# EAGLE design prototype (EAGLE 9.0.1)
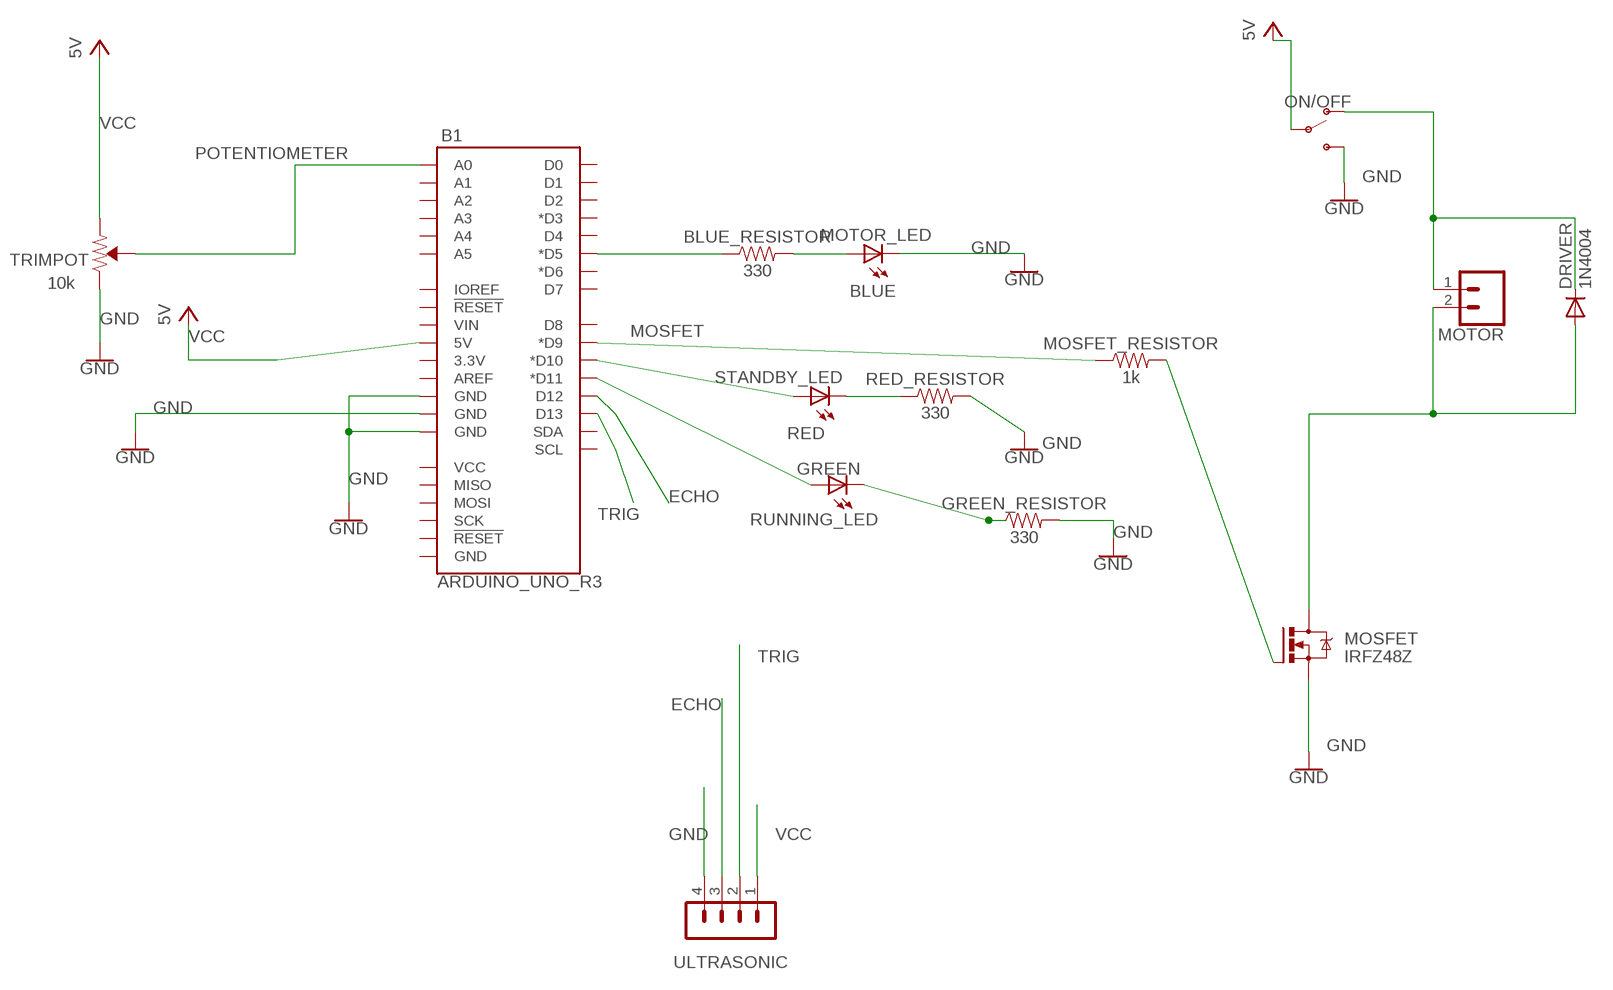
[diagram p0: schematic, sheet 1]

## Parts
B1  ARDUINO_UNO_R3  [ARDUINO_R3]
BLUE_RESISTOR  330  1KOHM-HORIZ-1/4W-1%  [AXIAL-0.3]
DRIVER  1N4004  [DO41-10]
GREEN_RESISTOR  330  330OHM-HORIZ-1/10W-5%  [AXIAL-0.3]
MOSFET  IRFZ48Z  [TO220BH]
MOSFET_RESISTOR  1k  1KOHM-HORIZ-1/4W-1%  [AXIAL-0.3]
MOTOR  CONN_02  [1X02]
MOTOR_LED  BLUE  LED5MM  [LED5MM]
ON/OFF  SWITCH-SPDT-PTH-11.6X4.0MM  [SWITCH_SPDT_PTH_11.6X4.0MM]
RED_RESISTOR  330  330OHM-HORIZ-1/10W-5%  [AXIAL-0.3]
RUNNING_LED  GREEN  LED5MM  [LED5MM]
STANDBY_LED  RED  LED5MM  [LED5MM]
TRIMPOT  10k  TRIMPOT-PTH-10MM-KNOB-1/2W-10%  [TRIMPOT-PTH-3386U]
ULTRASONIC  MA04-1  [MA04-1]

## Nets
BLUE: B1.D5(*D5) BLUE_RESISTOR.P$1
ECHO: B1.D12 ULTRASONIC.3
GND: B1.GND@2(GND) B1.GND@3(GND) B1.GND@4(GND) GREEN_RESISTOR.P$2 MOSFET.S MOTOR_LED.K(C) ON/OFF.3(S) RED_RESISTOR.P$2 TRIMPOT.3(CW) ULTRASONIC.4
GREEN: B1.D11(*D11) RUNNING_LED.A
MOSFET: B1.D9(*D9) MOSFET_RESISTOR.P$1
N$1: DRIVER.C MOTOR.1 ON/OFF.1(O)
N$4: RED_RESISTOR.P$1 STANDBY_LED.K(C)
N$5: GREEN_RESISTOR.P$1 RUNNING_LED.K(C)
N$7: MOSFET.G MOSFET_RESISTOR.P$2
N$8: BLUE_RESISTOR.P$2 MOTOR_LED.A
N$9: DRIVER.A MOSFET.D MOTOR.2
POTENTIOMETER: B1.A0 TRIMPOT.2(WIPER)
RED: B1.D10(*D10) STANDBY_LED.A
TRIG: B1.D13 ULTRASONIC.2
VCC [Power]: B1.5V ON/OFF.2(P) TRIMPOT.1(CCW) ULTRASONIC.1 ; supply symbol labelled 5V
Unconnected: B1.3.3V B1.A1 B1.A2 B1.A3 B1.A4 B1.A5 B1.AREF B1.D0 B1.D1 B1.D2 B1.D3(*D3) B1.D4 B1.D6(*D6) B1.D7 B1.D8 B1.GND@1(GND) B1.IOREF B1.MISO B1.MOSI B1.RESET@1(!RESET!) B1.RESET@2(!RESET!) B1.SCK B1.SCL B1.SDA B1.VCC B1.VIN

## Library data of the parts
B1 = SparkFun-Boards:ARDUINO_UNO_R3: Arduino R3 Footprint with SPI header Arduino Uno R3 Compatible Footprint. Matches PCB size of the original board. SparkFun Products: SAMD21 Dev Breakout <https://www.sparkfun.com/products/13672> RedBoard <https://www.sparkfun.com/products/12757> R3 Stackable Headers <https://www.sparkfun.com/products/11417>
BLUE_RESISTOR = SparkFun-Resistors:1KOHM: 1kΩ resistor A resistor is a passive two-terminal electrical component that implements electrical resistance as a circuit element. Resistors act to reduce current flow, and, at the same time, act to lower voltage levels within circuits. - Wikipedia; PROD_ID: RES-12182; VALUE: 1k
DRIVER = diode:1N4004: DIODE general purpose rectifier, 1 A
GREEN_RESISTOR RED_RESISTOR = SparkFun-Resistors:330OHM: 330Ω resistor A resistor is a passive two-terminal electrical component that implements electrical resistance as a circuit element. Resistors act to reduce current flow, and, at the same time, act to lower voltage levels within circuits. - Wikipedia; PROD_ID: RES-8371
MOSFET = transistor-power:IRFZ48: N Channel HEXFET® Power MOSFET Logic Level Source: http://www.irf.com/product-info/datasheets/data/irfz48z.pdf
MOSFET_RESISTOR = SparkFun-Resistors:1KOHM: 1kΩ resistor A resistor is a passive two-terminal electrical component that implements electrical resistance as a circuit element. Resistors act to reduce current flow, and, at the same time, act to lower voltage levels within circuits. - Wikipedia; PROD_ID: RES-12182
MOTOR = SparkFun-Connectors:CONN_02: Multi connection point. Often used as Generic Header-pin footprint for 0.1 inch spaced/style header connections On any of the 0.1 inch spaced packages, you can populate with these: Break Away Headers - Straight <https://www.sparkfun.com/products/116> (PRT-00116) Break Away Male Headers - Right Angle <https://www.sparkfun.com/products/553> (PRT-00553) Female Headers <https://www.sparkfun.com/products/115> (PRT-00115) Break Away Headers - Machine Pin <https://www.sparkfun.com/products/117> (PRT-00117) Break Away Female Headers - Swiss Machine Pin <https://www.sparkfun.com/products/743> (PRT-00743) For SCREWTERMINALS and SPRING TERMINALS visit here: Screw Terimnals on SparkFun.com <https://www.sparkfun.com/search/results?term=Screw+Terminals> (5mm/3.5mm/2.54mm spacing) This device is also useful as a general connection point to wire up your design to another part of your project. Our various solder wires solder well into these plated through hole pads. Hook-Up Wire - Assortment (Stranded, 22 AWG) <https://www.sparkfun.com/products/11375> (PRT-11375) Hook-Up Wire - Assortment (Solid Core, 22 AWG) <https://www.sparkfun.com/products/11367> (PRT-11367) View the entire wire category on our website here <https://www.sparkfun.com/categories/141> Special notes: Molex polarized connector foot print use with: PRT-08233 with associated crimp pins and housings. 2.54_SCREWTERM for use with PRT-10571. 3.5mm Screw Terminal footprints for PRT-08084 5mm Screw Terminal footprints for use with PRT-08432
MOTOR_LED RUNNING_LED STANDBY_LED = led:LED: LED OSRAM: - CHIPLED LG R971, LG N971, LY N971, LG Q971, LY Q971, LO R971, LY R971 LH N974, LH R974 LS Q976, LO Q976, LY Q976 LO Q996 - Hyper CHIPLED LW Q18S LB Q993, LB Q99A, LB R99A - SideLED LS A670, LO A670, LY A670, LG A670, LP A670 LB A673, LV A673, LT A673, LW A673 LH A674 LY A675 LS A676, LA A676, LO A676, LY A676, LW A676 LS A679, LY A679, LG A679 - Hyper Micro SIDELED® LS Y876, LA Y876, LO Y876, LY Y876 LT Y87S - SmartLED LW L88C, LW L88S LB L89C, LB L89S, LG L890 LS L89K, LO L89K, LY L89K LS L896, LA L896, LO L896, LY L896 - TOPLED LS T670, LO T670, LY T670, LG T670, LP T670 LSG T670, LSP T670, LSY T670, LOP T670, LYG T670 LG T671, LOG T671, LSG T671 LB T673, LV T673, LT T673, LW T673 LH T674 LS T676, LA T676, LO T676, LY T676, LB T676, LH T676, LSB T676, LW T676 LB T67C, LV T67C, LT T67C, LS T67K, LO T67K, LY T67K, LW E67C LS E67B, LA E67B, LO E67B, LY E67B, LB E67C, LV E67C, LT E67C LW T67C LS T679, LY T679, LG T679 LS T770, LO T770, LY T770, LG T770, LP T770 LB T773, LV T773, LT T773, LW T773 LH T774 LS E675, LA E675, LY E675, LS T675 LS T776, LA T776, LO T776, LY T776, LB T776 LHGB T686 LT T68C, LB T68C - Hyper Mini TOPLED® LB M676 - Mini TOPLED Santana® LG M470 LS M47K, LO M47K, LY M47K Source: http://www.osram.convergy.de LUXEON: - LUMILED® LXK2-PW12-R00, LXK2-PW12-S00, LXK2-PW14-U00, LXK2-PW14-V00 LXK2-PM12-R00, LXK2-PM12-S00, LXK2-PM14-U00 LXK2-PE12-Q00, LXK2-PE12-R00, LXK2-PE12-S00, LXK2-PE14-T00, LXK2-PE14-U00 LXK2-PB12-K00, LXK2-PB12-L00, LXK2-PB12-M00, LXK2-PB14-N00, LXK2-PB14-P00, LXK2-PB14-Q00 LXK2-PR12-L00, LXK2-PR12-M00, LXK2-PR14-Q00, LXK2-PR14-R00 LXK2-PD12-Q00, LXK2-PD12-R00, LXK2-PD12-S00 LXK2-PH12-R00, LXK2-PH12-S00 LXK2-PL12-P00, LXK2-PL12-Q00, LXK2-PL12-R00 Source: www.luxeon.com KINGBRIGHT: KA-3528ASYC Source: www.kingbright.com
ON/OFF = SparkFun-Switches:SWITCH-SPDT: Single Pole, Double Throw (SPDT) Switch Single-pole, double-throw (SPDT) switch. Variant Overview SMD-AYZ0202 Surface Mount DPDT Switch <https://www.sparkfun.com/products/597> (COM-00597) Used on e.g. LilyPad Arduino USB - ATmega32U4 Board <https://www.sparkfun.com/products/12049> PTH-11.6X4.0MM SPDT Mini Power Switch <https://www.sparkfun.com/products/102> (COM-00102) Used on e.g. SparkFun Simon Says - Through-Hole Soldering Kit <https://www.sparkfun.com/products/10547> (KIT-10547) PTH-11.6X4.0MM-KIT KIT version of SPDT Mini Power Switch - Simplifies soldering by removing tStop of switch pins - only one side can be soldered. PTH-11.6X4.0MM-LOCK LOCK version of SPDT Mini Power Switch - Offset pins hold switch in place for easier soldering. SMD-RIGHT-ANGLE Surface Mount Right Angle Switch <https://www.sparkfun.com/products/10860> (COM-10860) Used on e.g. SparkFun ESP8266 Thing <https://www.sparkfun.com/products/13231>; PROD_ID: SWCH-08261; SF_SKU: COM-00102
TRIMPOT = SparkFun-Resistors:TRIMPOT: Trimming Potentiometer (Trimpot) Three-terminal potentiometers, with an adjustable wiper and two adjustable resistors. A pot can be used to create a configurable voltage divider, or as a variable resistor. "Trimpots" are a subset of potentiometers, usually intended for "set-and-forget" applications. They're often more delicate than standard potentiometers - rated for fewer turns. Variants PTH-KNOB - PTH Trimpot w/ finger-adjustable knob Trimpot 10K with Knob <https://www.sparkfun.com/products/9806> (COM-09806) Datasheet <http://www.sparkfun.com/datasheets/Components/General/TSR-3386.pdf> SMD-3MM-CLOSED-FRAME - SMD 3mm Square Closed-Frame Trimpot Used on e.g. EasyDriver - Stepper Motor Driver <https://www.sparkfun.com/products/12779> Datasheet <http://www.bitechnologies.com/pdfs/22.pdf> (22AR10KTR) SMD-5MM - SMD 5mm Square Closed-Frame Trimpot Used on e.g. IOIO-OTG - V2.2 <https://www.sparkfun.com/products/13613> Datasheet <http://www.vishay.com/docs/51008/ts53.pdf> (TS53YL502MR10) SMD-3MM-1/10W-25% - 3mm Square Open-Frame Trimpot Used on e.g. SparkFun Shapeoko <https://www.sparkfun.com/products/13899> Datasheet <http://www.bourns.com/docs/Product-Datasheets/TC33.pdf> (TC33X-2-103E); PROD_ID: RES-09730; SF_SKU: COM-09806
ULTRASONIC = con-lstb:MA04-1: PIN HEADER; OC_FARNELL: unknown; OC_NEWARK: unknown

## Net classes
0 default: width 0.203 mm, drill 0.254 mm, clearance 0.254 mm
1 Power: width 0.254 mm, drill 0.305 mm, clearance 0.254 mm

## Board
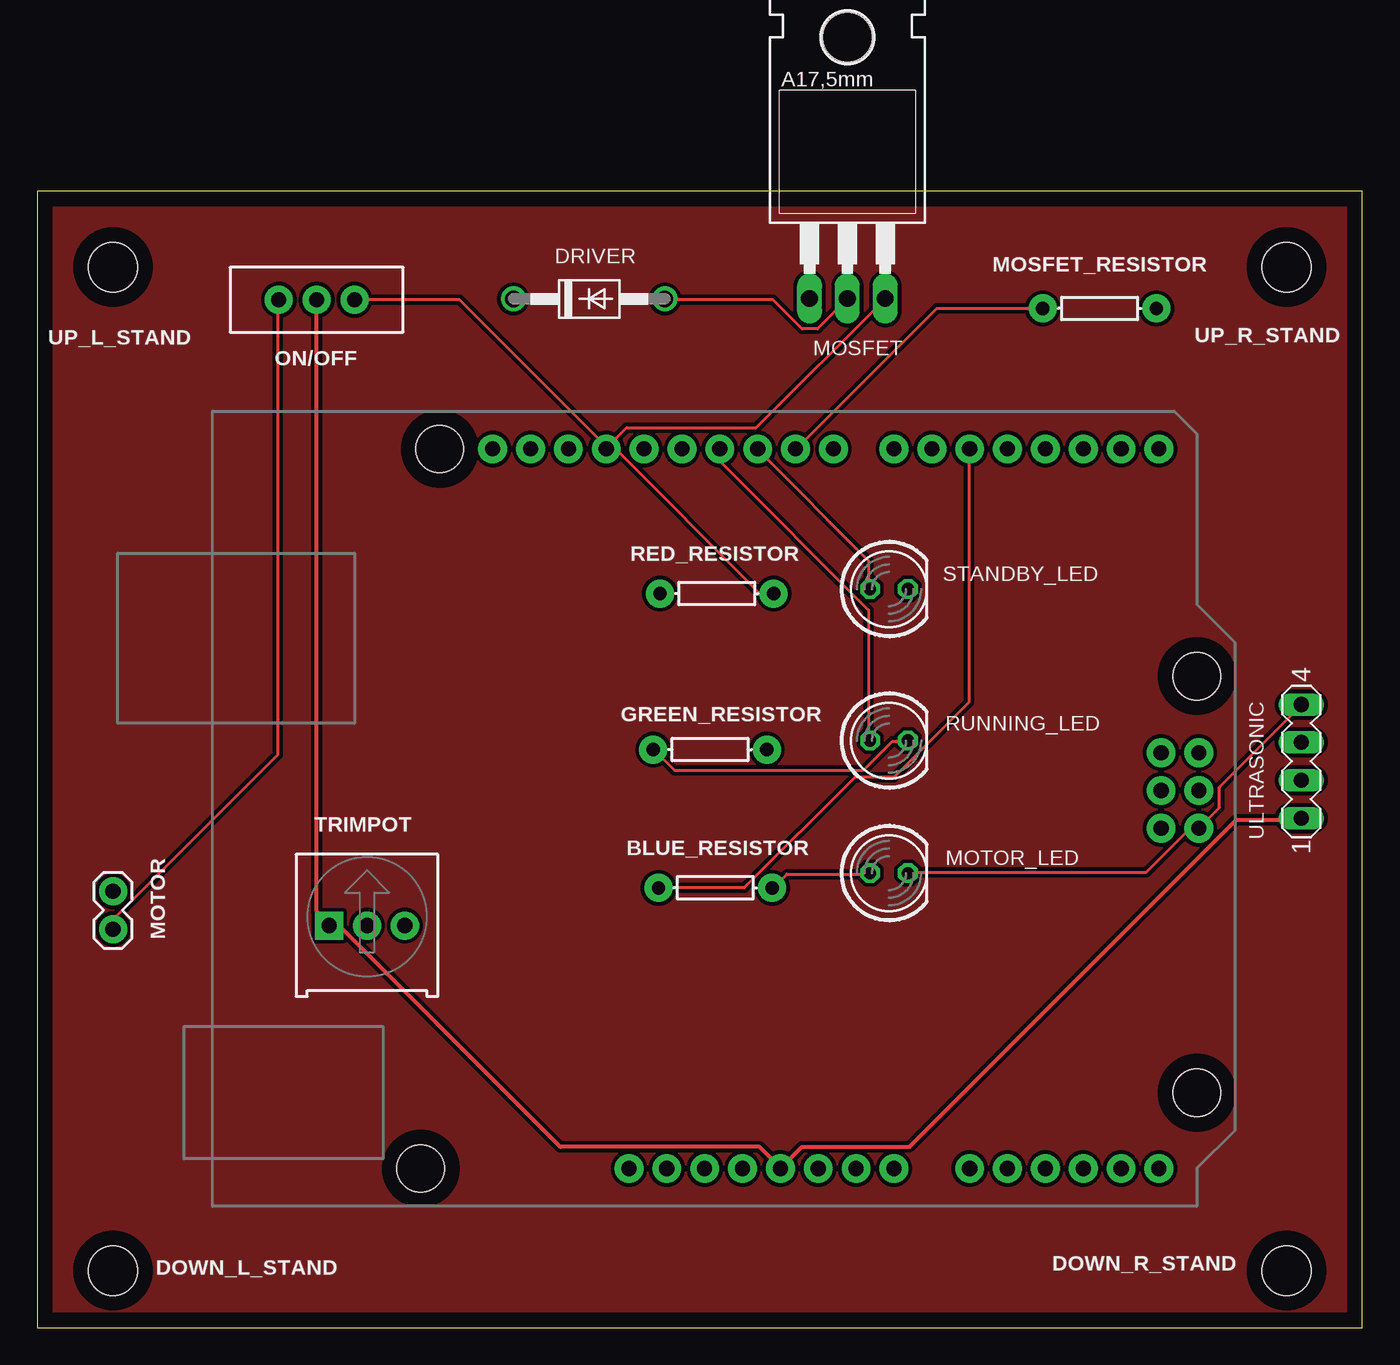
[diagram p1: board, top side]
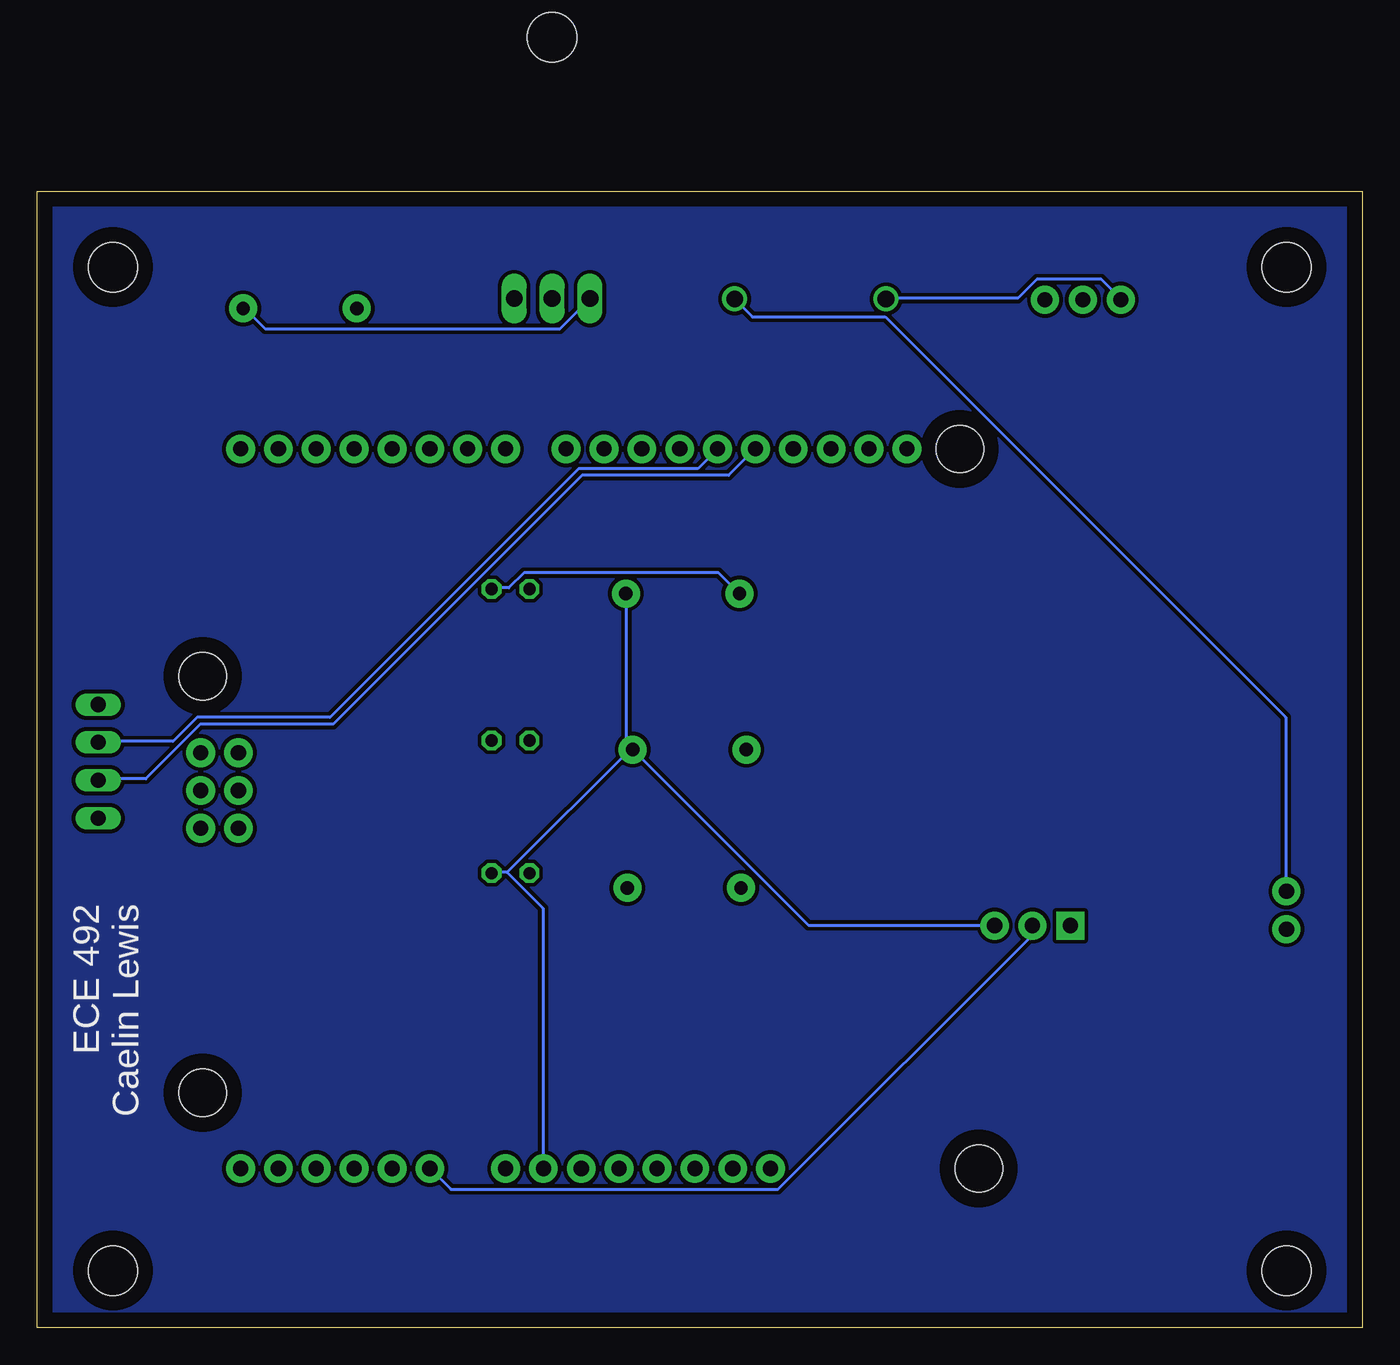
[diagram p2: board, bottom side, seen from below]

Size 88.9 x 76.2 mm. Coordinates in mm from the lower left corner, seen from the top.
Outline: 0,0 88.9,0 88.9,76.2 0,76.2 0,0
Copper layers (1*16): Top 0.035mm / dielectric 1.5mm / Bottom 0.035mm
Design rules "default *": minimum track width 6mil, minimum drill 0.35mm, track to track 10mil, track to pad 10mil, pad to pad 10mil, via to via 10mil, smd to smd 10mil, copper to edge 40mil, drill to drill 6mil, minimum pad ring 10mil, minimum via ring 8mil, stop-mask expansion 4mil, vias tented up to drill 0mil, thermal gap 10mil

### Footprints (pad centres in the part's own frame; a part is rotated, then mirrored left to right if it is on the bottom)
ARDUINO_R3 = drill 1.016 pad 1.93: 3.3V 2.54,-24.13; 5V 5.08,-24.13; A0 17.78,-24.13; A1 20.32,-24.13; A2 22.86,-24.13; A3 25.4,-24.13; A4 27.94,-24.13; A5 30.48,-24.13; AREF -9.144,24.13; D0 30.48,24.13; D1 27.94,24.13; D2 25.4,24.13; D3 22.86,24.13; D4 20.32,24.13; D5 17.78,24.13; D6 15.24,24.13; D7 12.7,24.13; D8 8.636,24.13; D9 6.096,24.13; D10 3.556,24.13; D11 1.016,24.13; D12 -1.524,24.13; D13 -4.064,24.13; GND@1 7.62,-24.13; GND@2 10.16,-24.13; GND@3 -6.604,24.13; GND@4 33.16,-1.32; IOREF -2.54,-24.13; MISO 30.62,3.76; MOSI 33.16,1.22; NC -5.08,-24.13; RESET@1 0,-24.13; RESET@2 30.62,-1.32; SCK 30.62,1.22; SCL -14.224,24.13; SDA -11.684,24.13; VCC 33.16,3.76; VIN 12.7,-24.13 | hole 3.175: -17.78,24.13; 33.02,8.89; 33.02,-19.05; -19.05,-24.13
AXIAL-0.3 = drill 0.9 pad 1.88: P$1 -3.81,0; P$2 3.81,0
STAND-OFF = hole 3.302: 0,0
DO41-10 = drill 1.118: A 5.08,0; C -5.08,0
TO220BH = drill 1.118 long: D 0,-6.35; G -2.54,-6.35; S 2.54,-6.35 | hole 3.302: 0,11.176
1X02 = drill 1.016 pad 1.88: 1 0,0; 2 2.54,0
LED5MM = drill 0.813 octagon: A -1.27,0; K 1.27,0
SWITCH_SPDT_PTH_11.6X4.0MM = drill 1.016 pad 1.88: 1 0,2.54; 2 0,0; 3 0,-2.54
TRIMPOT-PTH-3386U = drill 1.016 pad 1.88 square: 1 -2.54,-0.015 | drill 1.016 pad 1.88: 2 0,-0.015; 3 2.54,-0.015
MA04-1 = drill 1.016 long: 1 -3.81,0; 2 -1.27,0; 3 1.27,0; 4 3.81,0

### Placement (x,y rotation side)
B1  44.78,34.8 0 top
BLUE_RESISTOR  45.49,29.49 0 top
DOWN_L_STAND  [STAND-OFF]  5.08,3.81 0 top
DOWN_R_STAND  [STAND-OFF]  83.82,3.81 0 top
DRIVER  37.03,68.99 0 top
GREEN_RESISTOR  45.14,38.76 0 top
MOSFET  54.36,75.36 0 top
MOSFET_RESISTOR  71.27,68.35 0 top
MOTOR  5.08,26.72 90 top
MOTOR_LED  57.15,30.48 0 top
ON/OFF  18.75,68.94 90 top
RED_RESISTOR  45.59,49.23 0 top
RUNNING_LED  57.15,39.37 0 top
STANDBY_LED  57.15,49.53 0 top
TRIMPOT  22.12,26.97 0 top
ULTRASONIC  84.81,37.97 90 top
UP_L_STAND  [STAND-OFF]  5.08,71.12 0 top
UP_R_STAND  [STAND-OFF]  83.82,71.12 0 top

### Tracks (layer width: path | path; a pad name or v marks a point on that pad's centre or on a via)
BLUE
  Top 0.203: BLUE_RESISTOR.P$1 47.43,29.49 54.86,36.92 57.49,36.92 62.52,41.95 62.52,58.86 B1.D5
ECHO
  Bottom 0.203: B1.D12 44.58,57.61 52.58,57.61 69.27,40.92 78.18,40.92 79.78,39.32 84.81,39.32 ULTRASONIC.3
GND
  Top 0.203: MOSFET.S 48.23,60.35 39.55,60.35 38.18,58.98 B1.GND@3 | ON/OFF.3 21.37,68.92 28.35,68.92 38.18,59.09 B1.GND@3 | ULTRASONIC.4 84.81,41.72 79.32,36.23 79.32,34.86 77.95,33.49 B1.GND@4 77.84,33.38 77.27,33.38 74.41,30.52 58.52,30.52 MOTOR_LED.K | B1.GND@3 38.52,59.21 48.46,49.26 49.38,49.26 RED_RESISTOR.P$2
  Bottom 0.203: 57.38,30.52 58.41,30.52 MOTOR_LED.K | 57.38,30.52 49.03,38.86 GREEN_RESISTOR.P$2 | TRIMPOT.3 24.69,26.98 37.15,26.98 48.92,38.75 GREEN_RESISTOR.P$2 | RED_RESISTOR.P$2 49.38,49.15 49.38,39.09 49.15,38.86 GREEN_RESISTOR.P$2 | 57.38,30.52 54.98,28.12 54.98,10.74 B1.GND@2
GREEN
  Top 0.203: RUNNING_LED.A 55.78,39.43 55.78,48.12 45.83,58.06 45.83,58.86 B1.D11
MOSFET
  Top 0.203: MOSFET_RESISTOR.P$1 60.35,68.35 50.98,58.98 B1.D9
N$1
  Top 0.203: MOTOR.1 5.14,26.75 5.14,27.43 16.12,38.41 16.12,68.92 ON/OFF.1
  Bottom 0.203: DRIVER.C 31.89,69.04 23.09,69.04 21.83,70.29 17.49,70.29 16.23,69.04 ON/OFF.1
N$2
  pour Top: 0,76.2 88.9,76.2 88.9,0 0,0
N$3
  pour Bottom: 0,76.2 88.9,76.2 88.9,0 0,0
N$4
  Bottom 0.203: STANDBY_LED.K 58.41,49.61 57.26,49.61 56.24,50.63 43.2,50.63 41.83,49.26 RED_RESISTOR.P$1
N$5
  Top 0.203: RUNNING_LED.K 58.41,39.32 57.38,39.32 55.44,37.38 42.75,37.38 41.38,38.75 GREEN_RESISTOR.P$1
N$7
  Bottom 0.203: MOSFET.G 51.89,68.92 53.84,66.98 73.61,66.98 74.98,68.35 MOSFET_RESISTOR.P$2
N$8
  Top 0.203: MOTOR_LED.A 55.78,30.4 50.29,30.4 49.38,29.49 BLUE_RESISTOR.P$2
N$9
  Top 0.203: DRIVER.A 42.18,68.92 49.38,68.92 51.32,66.98 52.35,66.98 54.29,68.92 MOSFET.D
  Bottom 0.203: MOTOR.2 5.14,29.26 5.14,40.92 32,67.78 40.92,67.78 42.06,68.92 DRIVER.A
POTENTIOMETER
  Bottom 0.203: B1.A0 61.15,9.26 39.2,9.26 22.17,26.29 22.17,26.86 TRIMPOT.2
RED
  Top 0.203: STANDBY_LED.A 55.78,49.61 55.78,51.44 48.35,58.86 B1.D10
TRIG
  Bottom 0.203: ULTRASONIC.2 84.81,36.8 81.61,36.8 77.95,40.46 69.04,40.46 52.35,57.15 42.52,57.15 40.8,58.86 B1.D13
VCC
  Top 0.254: ULTRASONIC.1 84.81,34.06 80.47,34.06 58.52,12.12 51.32,12.12 49.95,10.74 B1.5V 49.84,10.74 48.46,12.12 35.09,12.12 20.34,26.86 19.66,26.86 TRIMPOT.1 19.55,27.09 18.75,27.89 ON/OFF.2

### Text on the board
bNames: ECE 492 / Caelin Lewis